# EAGLE design Sensor Acquisition Board Rev1 (EAGLE 9.6.2)
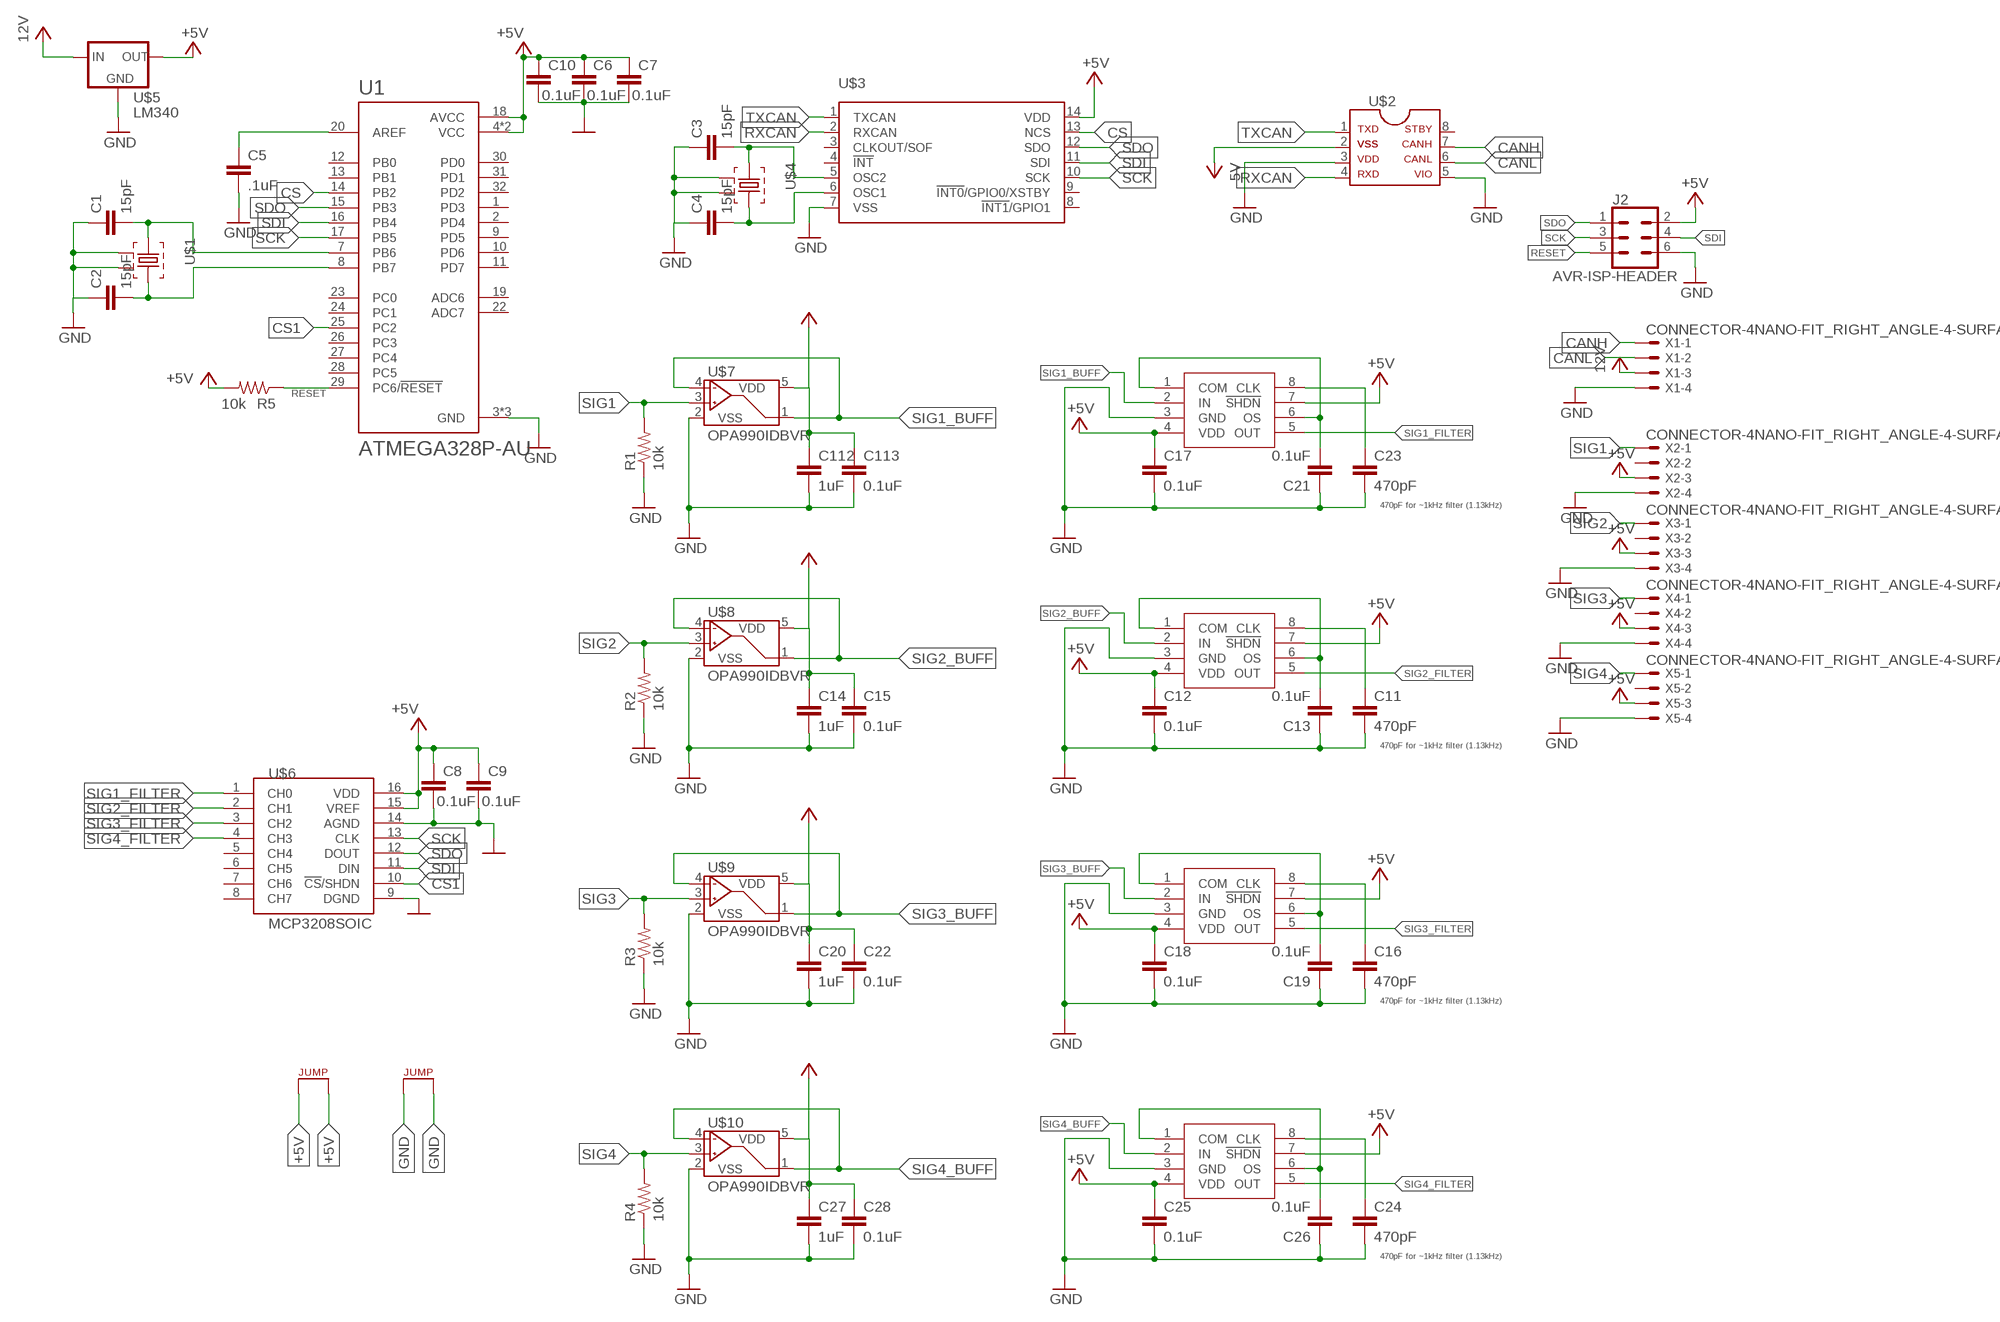
[diagram p0: schematic, sheet 1]

## Parts
C1  15pF  CAP0603-CAP  [0603-CAP]
C2  15pF  CAP0603-CAP  [0603-CAP]
C3  15pF  CAP0603-CAP  [0603-CAP]
C4  15pF  CAP0603-CAP  [0603-CAP]
C5  .1uF  CAP0603-CAP  [0603-CAP]
C6  0.1uF  CAP0603-CAP  [0603-CAP]
C7  0.1uF  CAP0603-CAP  [0603-CAP]
C8  0.1uF  CAP0603-CAP  [0603-CAP]
C9  0.1uF  CAP0603-CAP  [0603-CAP]
C10  0.1uF  CAP0603-CAP  [0603-CAP]
C11  470pF  CAP0603-CAP  [0603-CAP]
C12  0.1uF  CAP0603-CAP  [0603-CAP]
C13  0.1uF  CAP0603-CAP  [0603-CAP]
C14  1uF  CAP0603-CAP  [0603-CAP]
C15  0.1uF  CAP0603-CAP  [0603-CAP]
C16  470pF  CAP0603-CAP  [0603-CAP]
C17  0.1uF  CAP0603-CAP  [0603-CAP]
C18  0.1uF  CAP0603-CAP  [0603-CAP]
C19  0.1uF  CAP0603-CAP  [0603-CAP]
C20  1uF  CAP0603-CAP  [0603-CAP]
C21  0.1uF  CAP0603-CAP  [0603-CAP]
C22  0.1uF  CAP0603-CAP  [0603-CAP]
C23  470pF  CAP0603-CAP  [0603-CAP]
C24  470pF  CAP0603-CAP  [0603-CAP]
C25  0.1uF  CAP0603-CAP  [0603-CAP]
C26  0.1uF  CAP0603-CAP  [0603-CAP]
C27  1uF  CAP0603-CAP  [0603-CAP]
C28  0.1uF  CAP0603-CAP  [0603-CAP]
C112  1uF  CAP0603-CAP  [0603-CAP]
C113  0.1uF  CAP0603-CAP  [0603-CAP]
J1  JUMPER.1  [1X02]
J2  AVR-ISP-HEADER  [2X03]
J3  JUMPER.1  [1X02]
R1  10k  RESISTOR0603  [0603-RES]
R2  10k  RESISTOR0603  [0603-RES]
R3  10k  RESISTOR0603  [0603-RES]
R4  10k  RESISTOR0603  [0603-RES]
R5  10k  RESISTOR0603  [0603-RES]
U1  ATMEGA328P-AU  [QFP80P900X900X120-32N]
U2  MAX7480  [SOIC-08]
U3  MAX7480  [SOIC-08]
U4  MAX7480  [SOIC-08]
U24  MAX7480  [SOIC-08]
U$1  ABM3B  [ABM3B]
U$2  MCP2562FDSOIC-08  [SOIC-08]
U$3  MCP2518FD  [SOIC-14]
U$4  ABM3B  [ABM3B]
U$5  LM340  [SOT223]
U$6  MCP3208SOIC  [SOIC-16]
U$7  OPA990IDBVR  [SOT-23-5]
U$8  OPA990IDBVR  [SOT-23-5]
U$9  OPA990IDBVR  [SOT-23-5]
U$10  OPA990IDBVR  [SOT-23-5]
X1  CONNECTOR-4NANO-FIT_RIGHT_ANGLE-4-SURFACE  [NANO-FIT_RIGHT_ANGLE-4-SURFACE]
X2  CONNECTOR-4NANO-FIT_RIGHT_ANGLE-4-SURFACE  [NANO-FIT_RIGHT_ANGLE-4-SURFACE]
X3  CONNECTOR-4NANO-FIT_RIGHT_ANGLE-4-SURFACE  [NANO-FIT_RIGHT_ANGLE-4-SURFACE]
X4  CONNECTOR-4NANO-FIT_RIGHT_ANGLE-4-SURFACE  [NANO-FIT_RIGHT_ANGLE-4-SURFACE]
X5  CONNECTOR-4NANO-FIT_RIGHT_ANGLE-4-SURFACE  [NANO-FIT_RIGHT_ANGLE-4-SURFACE]

## Nets
+5V: C6.1 C7.1 C8.1 C9.1 C10.1 C12.1 C14.1 C15.1 C17.1 C18.1 C20.1 C22.1 C25.1 C27.1 C28.1 C112.1 C113.1 J1.1 J1.2 J2.2 R5.2 U1.4(VCC) U1.6(VCC) U1.18(AVCC) U2.4(VDD) U2.7(!SHDN) U3.4(VDD) U3.7(!SHDN) U4.4(VDD) U4.7(!SHDN) U24.4(VDD) U24.7(!SHDN) U$3.14(VDD) U$5.3(OUT) U$6.15(VREF) U$6.16(VDD) U$7.5(VDD) U$8.5(VDD) U$9.5(VDD) U$10.5(VDD) X2.3 X3.3 X4.3 X5.3
CANH: U$2.7 X1.1
CANL: U$2.6 X1.2
CS: U1.14(PB2) U$3.13(NCS)
CS1: U1.25(PC2) U$6.10(!CS!/SHDN)
GND: C1.1 C2.1 C3.1 C4.1 C5.2 C6.2 C7.2 C8.2 C9.2 C10.2 C11.2 C12.2 C13.1 C14.2 C15.2 C16.2 C17.2 C18.2 C19.1 C20.2 C21.1 C22.2 C23.2 C24.2 C25.2 C26.1 C27.2 C28.2 C112.2 C113.2 J2.6 J3.1 J3.2 R1.1 R2.1 R3.1 R4.1 U1.3(GND) U1.5(GND) U1.21(GND) U2.3(GND) U3.3(GND) U4.3(GND) U24.3(GND) U$1.GND U$1.GND2 U$2.3 U$2.5 U$3.7(VSS) U$4.GND U$4.GND2 U$5.2(GND) U$5.4(GND) U$6.9(DGND) U$6.14(AGND) U$7.2(VSS) U$8.2(VSS) U$9.2(VSS) U$10.2(VSS) X1.4 X2.4 X3.4 X4.4 X5.4
N$2: C1.2 U1.7(PB6) U$1.1
N$3: C2.2 U1.8(PB7) U$1.3
N$4: C3.2 U$3.5(OSC2) U$4.1
N$5: C4.2 U$3.6(OSC1) U$4.3
N$6: C11.1 U2.8(CLK)
N$7: C13.2 U2.1(COM) U2.6(OS)
N$8: C5.1 U1.20(AREF)
N$9: C16.1 U3.8(CLK)
N$10: C19.2 U3.1(COM) U3.6(OS)
N$11: C24.1 U4.8(CLK)
N$12: C26.2 U4.1(COM) U4.6(OS)
N$136: C23.1 U24.8(CLK)
N$142: C21.2 U24.1(COM) U24.6(OS)
RESET: J2.5 R5.1 U1.29(PC6/!RESET)
RXCAN: U$2.4 U$3.2(RXCAN)
SCK: J2.3 U1.17(PB5) U$3.10(SCK) U$6.13(CLK)
SDI: J2.4 U1.16(PB4) U$3.11(SDI) U$6.11(DIN)
SDO: J2.1 U1.15(PB3) U$3.12(SDO) U$6.12(DOUT)
SIG1: R1.2 U$7.3(VIN+) X2.1
SIG1_BUFF: U24.2(IN) U$7.1(VOUT) U$7.4(VIN-)
SIG1_FILTER: U24.5(OUT) U$6.1(CH0)
SIG2: R2.2 U$8.3(VIN+) X3.1
SIG2_BUFF: U2.2(IN) U$8.1(VOUT) U$8.4(VIN-)
SIG2_FILTER: U2.5(OUT) U$6.2(CH1)
SIG3: R3.2 U$9.3(VIN+) X4.1
SIG3_BUFF: U3.2(IN) U$9.1(VOUT) U$9.4(VIN-)
SIG3_FILTER: U3.5(OUT) U$6.3(CH2)
SIG4: R4.2 U$10.3(VIN+) X5.1
SIG4_BUFF: U4.2(IN) U$10.1(VOUT) U$10.4(VIN-)
SIG4_FILTER: U4.5(OUT) U$6.4(CH3)
TXCAN: U$2.1 U$3.1(TXCAN)
VCC: U$2.2 U$5.1(IN) X1.3 ; supply symbol labelled 5V, 12V
Unconnected: U1.1(PD3) U1.2(PD4) U1.9(PD5) U1.10(PD6) U1.11(PD7) U1.12(PB0) U1.13(PB1) U1.19(ADC6) U1.22(ADC7) U1.23(PC0) U1.24(PC1) U1.26(PC3) U1.27(PC4) U1.28(PC5) U1.30(PD0) U1.31(PD1) U1.32(PD2) U$2.8 U$3.3(CLKOUT/SOF) U$3.4(!INT!) U$3.8(!INT1!/GPIO1) U$3.9(!INT0!/GPIO0/XSTBY) U$6.5(CH4) U$6.6(CH5) U$6.7(CH6) U$6.8(CH7) X2.2 X3.2 X4.2 X5.2

## Notes on the sheet
- 470pF for ~1kHz filter (1.13kHz)
- 470pF for ~1kHz filter (1.13kHz)
- 470pF for ~1kHz filter (1.13kHz)
- 470pF for ~1kHz filter (1.13kHz)

## Library data of the parts
C1-C28 C112 C113 = HyTechDevices:CAP: Capacitor Standard 0603 ceramic capacitor, and 0.1" leaded capacitor.
J1 J3 = HyTechDevices:JUMPER: Jumper for changing operation of a device
J2 = HyTechDevices:AVR-ISP-HEADER: AVR ISP 6-pin Header Reference <https://en.wikipedia.org/wiki/In-system_programming>; DIGIKEY: S2011EC-03-ND
R1-R5 = HyTechDevices:RESISTOR: Resistor Basic schematic elements and footprints for 0603, 1206, and PTH resistors.
U1 = HyTechDevices:ATMEGA328P-AU: ATmega Series 20 MHz 32 KB Flash 2 KB SRAM 8-Bit Microcontroller - TQFP-32; AVAILABILITY: Unavailable; DESCRIPTION: AVR AVR® ATmega Microcontroller IC 8-Bit 20MHz 32KB _16K x 16_ FLASH 32-TQFP _7x7_; MF: Microchip; MP: ATMEGA328P-AU; PACKAGE: TQFP-32 Microchip; PRICE: None
U2-U4 U24 = HyTechDevices:MAX7480: 8th-order lowpass butterworth filter
U$1 U$4 = HyTechDevices:ABM3B: ABM3B ceramic SMD crystal. Datasheet <https://www.mouser.com/datasheet/2/3/abm3b-39910.pdf>
U$2 = HyTechDevices:MCP2562FD: MCP2562FD High-speed CAN Transceiver Datatsheet <http://ww1.microchip.com/downloads/en/devicedoc/20005167c.pdf>
U$3 = HyTechDevices:MCP2518FD: MCP2518FD - External CAN FD Controller with SPI Interface Datasheet <https://ww1.microchip.com/downloads/en/DeviceDoc/External-CAN-FD-Controller-with-SPI-Interface-DS20006027B.pdf>
U$5 = HyTechDevices:LM340: LM340 7.5-35V to 5V SMD regulator Mouser link <https://www.mouser.com/ProductDetail/Texas-Instruments/LM340MPX-50-NOPB?qs=sGAEpiMZZMvu8NZDyZ4K0cQiG3JqdhEW>
U$6 = HyTechDevices:MCP3208: Analog to Digital Converter
U$7-U$10 = HyTechDevices:OPA990IDBVR: TI OPA990 20V Op-Amp Comparator Datasheet <https://www.ti.com/lit/ds/symlink/opa990.pdf>
X1-X5 = HyTechDevices:CONNECTOR-4: Mini-Fit Junior connector 4 pole Source: http://www.molex.com

## Board
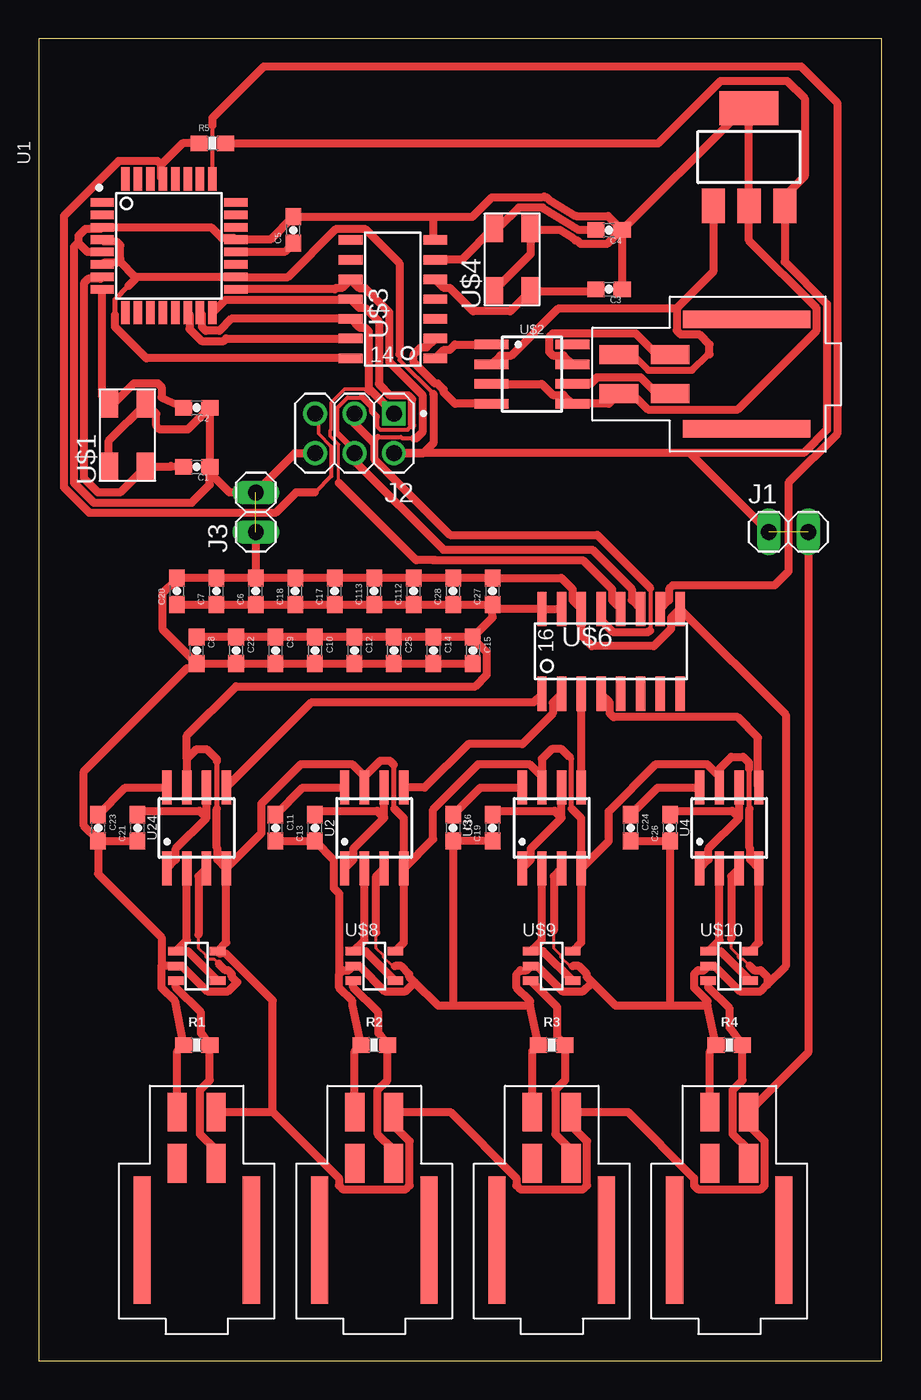
[diagram p1: board, top side]

Size 54.28 x 85.08 mm. Coordinates in mm from the lower left corner, seen from the top.
Outline: 0,0 54.28,0 54.28,85.08 0,85.08 0,0
Copper layers (1*16): Top 0.035mm / dielectric 1.5mm / Bottom 0.035mm
Design rules "default": minimum track width 6mil, minimum drill 0.35mm, track to track 6mil, track to pad 6mil, pad to pad 6mil, via to via 6mil, smd to smd 6mil, copper to edge 40mil, drill to drill 6mil, minimum pad ring 10mil, minimum via ring 8mil, stop-mask expansion 4mil, vias tented up to drill 0mil, thermal gap 10mil

### Footprints (pad centres in the part's own frame; a part is rotated, then mirrored left to right if it is on the bottom)
0603-CAP = smd 1.1 x 1: 1 -0.85,0; 2 0.85,0
1X02 = drill 1.016 long: 1 -1.27,0; 2 1.27,0
2X03 = drill 1.016 square: 1 -2.54,-1.27 | drill 1.016: 2 -2.54,1.27; 3 0,-1.27; 4 0,1.27; 5 2.54,-1.27; 6 2.54,1.27
0603-RES = smd 1.1 x 1: 1 -0.85,0; 2 0.85,0
QFP80P900X900X120-32N = smd 1.5 x 0.55: 1 -4.3,2.8; 2 -4.3,2; 3 -4.3,1.2; 4 -4.3,0.4; 5 -4.3,-0.4; 6 -4.3,-1.2; 7 -4.3,-2; 8 -4.3,-2.8; 17 4.3,-2.8; 18 4.3,-2; 19 4.3,-1.2; 20 4.3,-0.4; 21 4.3,0.4; 22 4.3,1.2; 23 4.3,2; 24 4.3,2.8 | smd 0.55 x 1.5: 9 -2.8,-4.3; 10 -2,-4.3; 11 -1.2,-4.3; 12 -0.4,-4.3; 13 0.4,-4.3; 14 1.2,-4.3; 15 2,-4.3; 16 2.8,-4.3; 25 2.8,4.3; 26 2,4.3; 27 1.2,4.3; 28 0.4,4.3; 29 -0.4,4.3; 30 -1.2,4.3; 31 -2,4.3; 32 -2.8,4.3
SOIC-08 = smd 0.6 x 2.2: 1 -1.905,-2.6; 2 -0.635,-2.6; 3 0.635,-2.6; 4 1.905,-2.6; 5 1.905,2.6; 6 0.635,2.6; 7 -0.635,2.6; 8 -1.905,2.6
ABM3B = smd 1.803 x 1.194: 1 0.902,0.597; 3 4.966,2.985; GND 0.902,2.985; GND2 4.966,0.597
SOIC-14 = smd 0.61 x 1.524: 1 -4.445,-2.794; 2 -3.175,-2.794; 3 -1.905,-2.794; 4 -0.635,-2.794; 5 0.635,-2.794; 6 1.905,-2.794; 7 3.175,-2.794; 8 3.175,2.667; 9 1.905,2.667; 10 0.635,2.667; 11 -0.635,2.667; 12 -1.905,2.667; 13 -3.175,2.667; 14 -4.445,2.667
SOT223 = smd 1.5 x 2.235: 1 -2.3,-3.15; 2 0,-3.15; 3 2.3,-3.15 | smd 3.8 x 2.2: 4 0,3.15
SOIC-16 = smd 0.6 x 2.2: 1 -4.445,-2.794; 2 -3.175,-2.794; 3 -1.905,-2.794; 4 -0.635,-2.794; 5 0.635,-2.794; 6 1.905,-2.794; 7 3.175,-2.794; 8 4.445,-2.794; 9 4.445,2.667; 10 3.175,2.667; 11 1.905,2.667; 12 0.635,2.667; 13 -0.635,2.667; 14 -1.905,2.667; 15 -3.175,2.667; 16 -4.445,2.667
SOT-23-5 = smd 1 x 0.55: 1 -1.35,0.95; 2 -1.35,0; 3 -1.35,-0.95; 4 1.35,-0.95; 5 1.35,0.95
NANO-FIT_RIGHT_ANGLE-4-SURFACE = smd 1.24 x 2.5: 1 1.25,0; 2 -1.25,0; 3 1.25,3.3; 4 -1.25,3.3 | smd 1.1 x 8.2: P$5 -3.52,-4.93; P$6 3.52,-4.93

### Placement (x,y rotation side)
C1  10.16,57.53 180 top
C2  10.16,61.34 180 top
C3  36.7,68.96 180 top
C4  36.7,72.77 180 top
C5  16.38,72.77 90 top
C6  13.97,49.53 90 top
C7  11.43,49.53 90 top
C8  10.16,45.72 270 top
C9  15.24,45.72 270 top
C10  17.78,45.72 270 top
C11  15.24,34.29 270 top
C12  20.32,45.72 270 top
C13  17.78,34.29 90 top
C14  25.4,45.72 270 top
C15  27.94,45.72 270 top
C16  26.67,34.29 270 top
C17  19.05,49.53 90 top
C18  16.51,49.53 90 top
C19  29.21,34.29 90 top
C20  8.89,49.53 90 top
C21  6.35,34.29 90 top
C22  12.7,45.72 270 top
C23  3.81,34.29 270 top
C24  38.1,34.29 270 top
C25  22.86,45.72 270 top
C26  40.64,34.29 90 top
C27  29.21,49.53 90 top
C28  26.67,49.53 90 top
C112  24.13,49.53 90 top
C113  21.59,49.53 90 top
J1  48.26,53.34 0 top
J2  20.32,59.69 180 top
J3  13.97,54.61 90 top
R1  10.16,20.32 0 top
R2  21.59,20.32 0 top
R3  33.02,20.32 0 top
R4  44.45,20.32 0 top
R5  11.18,78.36 0 top
U1  8.38,71.75 0 top
U2  21.59,34.29 0 top
U3  33.02,34.29 0 top
U4  44.45,34.29 0 top
U24  10.16,34.29 0 top
U$1  7.49,56.64 90 top
U$2  31.75,63.5 270 top
U$3  22.73,68.96 90 top
U$4  32.26,67.94 90 top
U$5  45.72,77.47 0 top
U$6  36.83,45.72 0 top
U$7  10.16,25.4 0 top
U$8  21.59,25.4 0 top
U$9  33.02,25.4 0 top
U$10  44.45,25.4 0 top
X1  40.64,63.5 90 top
X2  10.16,12.7 0 top
X3  21.59,12.7 0 top
X4  33.02,12.7 0 top
X5  44.45,12.7 0 top

### Tracks (layer width: path | path; a pad name or v marks a point on that pad's centre or on a via)
+5V  (1 unrouted)
  Top 0.254: 23.22,64.77 23.22,64.41 25.4,62.23
  Top 0.33: 34.31,35.52 34.29,35.55 34.29,38.73 34.16,38.86 | 22.89,35.52 22.86,35.55 22.86,38.35 | 45.74,35.52 45.74,35.65 45.73,35.67 45.73,38.1 | 11.46,35.52 11.46,35.65 11.45,35.66 11.45,38.59 | 4.9,67.31 4.9,68.3 5.77,69.16
  Top 0.508: U$8.5 23.5,26.91 U2.4 | U$9.5 34.92,26.91 U3.4 | U$10.5 46.35,26.91 U4.4 45.79,32.25 45.79,32.96 45.74,33 45.74,35.52 | U24.4 12.07,26.91 U$7.5 11.65,26.21 12.03,26.21 15.07,23.18 15.07,16 | U$6.15 U$6.16 29.5,48.39 C27.1 | U2.4 25.38,33.58 25.38,35.48 28.3,38.4 31.58,38.4 32.39,37.59 | U3.4 36.69,33.45 36.69,35.35 39.73,38.4 43.01,38.4 43.81,37.59 U4.7 43.81,38.1 44.58,38.86 45.34,38.86 45.73,38.47 45.73,38.1 | U24.4 14.33,33.96 14.33,35.86 16.87,38.4 20.15,38.4 20.96,37.59 | U3.4 34.92,34.91 34.31,35.52 | 32.39,37.59 U3.7 | U2.4 23.5,34.91 22.89,35.52 | 22.86,38.35 22.61,38.61 21.97,38.61 20.96,37.59 | 20.96,37.59 U2.7 | U24.4 11.5,32.25 11.5,32.96 11.46,33 11.46,35.52 | 5.24,70.91 5.24,71.8 5,72.04 4.2,72.04 U1.4 | C15.1 27.94,46.49 28.85,45.59 28.85,44.15 28.1,43.41 12.7,43.41 9.52,40.23 9.52,38.73 | C20.1 C7.1 C6.1 C18.1 C17.1 C113.1 C112.1 C28.1 C27.1 | C15.1 29.21,47.84 C27.1 | C15.1 C14.1 C25.1 C12.1 C10.1 C9.1 C22.1 C8.1 | 9.52,38.73 10.16,39.37 10.79,39.37 11.45,38.72 11.45,38.59 | 9.52,38.73 U24.7 | 15.07,16 19.31,11.75 19.31,11.28 19.55,11.04 23.63,11.04 23.87,11.28 23.87,14.12 22.84,15.14 X3.3 26.5,16 30.74,11.75 30.74,11.28 30.98,11.04 35.06,11.04 35.3,11.28 35.3,14.12 34.27,15.14 X4.3 37.92,16 42.17,11.75 42.17,11.28 42.41,11.04 46.49,11.04 46.73,11.28 46.73,14.12 45.7,15.14 X5.3 49.53,19.83 J1.2 | 4.9,67.31 4.9,66.54 6.92,64.52 U$3.14 | 5.24,70.91 5,70.67 4.2,70.67 U1.6 | 6.22,69.75 U1.18 16.04,69.75 19.14,72.85 21,72.85 23.22,70.63 23.22,64.77 | 25.4,62.23 25.4,59.05 24.79,58.44 24.81,58.42 J2.2 41.91,58.42 | 41.91,58.42 49.23,58.42 50.74,59.92 50.74,68.01 48.02,70.73 U$5.3 48.02,74.95 49.3,76.23 49.3,81.25 48.17,82.38 43.91,82.38 39.88,78.36 R5.2
  Top 0.508: 5.77,69.16 6.22,69.62 6.22,69.75 | 6.22,69.75 5.24,70.73 5.24,70.91 | X2.3 15.07,16 | J1.1 41.91,58.42 | 34.16,38.86 33.66,39.37 33.02,39.37 32.39,38.73 32.39,37.59
CANH
  Top 0.508: X1.1 39.78,64.75 38.42,66.11 33.08,66.11 32.84,65.87 32.84,64.94 33.08,64.7 33.79,64.7 U$2.7
CANL
  Top 0.508: X1.2 39.78,62.25 38.76,63.28 35.92,63.28 35.51,62.87 U$2.6
CS
  Top 0.508: U1.14 9.7,67.34 9.7,66.4 10.46,65.64 11.9,65.64 12.05,65.79 U$3.13
CS1
  Top 0.254: U1.25 11.18,79.5
  Top 0.508: 11.18,79.5 11.18,79.99 14.48,83.3 49.08,83.3 51.4,80.97 51.4,59.65 48.26,56.51 48.26,50.8 47.35,49.89 40.81,49.89 40.57,49.66 40.57,48.95 U$6.10
GND  (1 unrouted)
  Top 0.203: 22.92,25.4 22.76,25.4 22.19,25.97 22.19,26.07 21.72,26.54 21.72,27.56 | 34.35,25.4 34.19,25.4 33.62,25.97 33.62,26.07 33.15,26.54 33.15,27.69 | 11.58,25.55 11.31,25.82 10.9,25.82 10.76,25.97 10.76,26.07 10.29,26.54 10.29,27.43 | 45.75,25.43 45.36,25.82 45.19,25.82 45.05,25.97 45.05,26.07 44.58,26.54 44.58,27.18
  Top 0.508: 19.33,24.89 19.33,24.01 20.19,23.15 20.19,22.86 R2.1 20.34,19.92 X3.4 | 19.33,24.89 19.57,25.13 19.97,25.13 U$8.2 20.64,25.4 22.27,23.77 23.61,23.77 24.2,24.36 | 31.62,22.86 R3.1 31.77,19.92 X4.4 | 31.62,22.86 31.62,23.15 30.76,24.01 30.76,24.89 31,25.13 31.4,25.13 U$9.2 32.07,25.4 33.7,23.77 35.04,23.77 35.63,24.36 | 43.05,22.86 R4.1 43.2,19.92 X5.4 | 43.05,22.86 43.05,23.15 42.19,24.01 42.19,24.89 42.43,25.13 42.83,25.13 U$10.2 43.5,25.4 45.13,23.77 46.47,23.77 46.91,24.21 | 46.91,24.21 48.08,25.38 48.08,41.59 U$6.9 40.71,47.82 40.71,47.12 39.58,45.99 35.6,45.99 34.92,46.67 U$6.14 34.36,48.95 34.36,49.66 33.64,50.38 C27.2 C28.2 C112.2 C113.2 C17.2 C18.2 C6.2 | 7.9,25.4 7.9,24.01 8.76,23.15 R1.1 8.91,19.92 X2.4 | 24.2,24.36 25.7,22.86 26.67,22.86 | 26.67,22.86 31.62,22.86 | 35.63,24.36 37.13,22.86 40.64,22.86 | 40.64,22.86 43.05,22.86 | 45.72,80.01 U$5.2 45.72,72.09 50.08,67.74 50.08,66.3 45,61.22 39.22,61.22 38.19,62.25 X1.4 36.69,61.59 U$2.5 33.79,62.16 33.08,62.16 32.38,62.87 U$2.3 | 45.72,80.01 U$5.4 | C8.2 C22.2 C9.2 C10.2 C12.2 C25.2 C14.2 C15.2 | C6.2 C7.2 C20.2 8.89,50.3 7.98,49.4 7.98,47.05 C8.2 | C26.1 40.64,33.02 | 40.64,33.02 40.64,22.86 | 26.67,22.86 C16.2 C19.1 | 7.9,25.4 7.9,27.24 3.81,31.33 C23.2 | C11.2 C13.1 18.98,32.24 18.98,30.42 19.33,30.07 19.33,24.89 | C24.2 40.22,33.44 40.64,33.02 | U1.5 4.06,71.38 3.13,71.38 2.54,71.96 | 24.2,24.36 23.85,24.72 23.85,24.89 23.34,25.4 22.92,25.4 | U2.3 21.72,31.18 21.72,27.56 | 35.63,24.36 35.28,24.72 35.28,24.89 34.77,25.4 34.35,25.4 | U3.3 33.15,31.18 33.15,27.69 | 11.58,25.55 12,25.13 12.18,25.13 12.42,24.89 12.42,24.72 12.77,24.36 12.18,23.77 10.84,23.77 9.21,25.4 U$7.2 7.9,25.4
  Top 0.508: U24.3 10.29,31.18 10.29,27.43 | C23.2 C21.1 | 44.58,27.18 44.58,31.18 U4.3 | C4.1 C3.1 | C4.1 37.48,72.77 36.57,71.86 34.89,71.86 34.69,72.06 34.62,72.11 34.53,72.11 34.39,72.25 33.53,72.77 31.8,72.77 U$4.GND2 31.66,71.23 U$4.GND | U$1.GND 4.51,59.22 U$1.GND2 7.55,60.95 7.55,60.17 7.79,59.94 9.58,59.94 10.99,61.34 C2.1 C1.1 11.01,57.15 | C23.2 3.81,33.52 2.9,34.42 2.9,37.94 9.54,44.57 9.86,44.57 C8.2 | 2.54,71.96 2.54,72.39 2.99,72.84 3.96,72.84 U1.3 11.08,72.95 11.76,72.27 12.56,72.27 U1.21 14.92,72.16 C5.2 25.4,73.62 | 2.54,71.96 2.27,71.69 2.27,56.49 3.54,55.22 9.84,55.22 11.01,56.38 11.01,57.15 | C4.1 36.65,73.68 34.58,73.68 32.84,74.74 32.7,74.88 32.61,74.88 32.54,74.92 32.35,74.88 29.17,74.88 27.91,73.62 25.4,73.62 | 45.72,80.01 44.79,80.01 C4.1 | U$3.7 25.4,72.26 25.4,73.62 | J3.1 C6.2 | 11.01,57.15 12.28,55.88 J3.2 16.51,58.42 J2.6 | 45.75,25.43 46.05,25.13 46.47,25.13 46.91,24.69 46.91,24.21
N$2
  Top 0.508: C1.2 8.5,57.59 8.46,57.54 U$1.1 5.23,55.88 3.81,55.88 2.93,56.76 2.93,69.4 3.16,69.64 3.96,69.64 U1.7
N$3
  Top 0.508: C2.2 7.9,62 7.9,62.68 7.66,62.92 6.13,62.92 4.82,61.61 U$1.3 4.08,62.03 U1.8
N$4
  Top 0.508: U$3.5 26.09,69.04 26.46,69.04 27.96,67.54 30.35,67.54 U$4.1 35.74,68.85 C3.2
N$5
  Top 0.508: C4.2 34.8,72.77 32.43,74.22 30.9,74.22 29.59,72.91 U$4.3 27.23,70.87 U$3.6
N$6
  Top 0.508: C11.1 16.99,36.89 U2.8
N$7
  Top 0.508: U2.1 20.25,32.25 20.25,32.96 22.22,34.94 | 22.22,34.94 U2.6 | C13.2 18.02,35.38 21.78,35.38 22.22,34.94
N$8
  Top 0.508: C5.1 15.82,71.36 U1.20
N$9
  Top 0.508: C16.1 28.42,36.89 U3.8
N$10
  Top 0.508: U3.1 31.68,32.25 31.68,32.96 33.66,34.94 | 33.66,34.94 U3.6 | C19.2 29.45,35.38 33.21,35.38 33.66,34.94
N$11
  Top 0.508: C24.1 39.85,36.89 U4.8
N$12
  Top 0.508: U4.1 43.11,32.25 43.11,32.96 45.08,34.94 | 45.08,34.94 U4.6 | C26.2 40.88,35.38 44.64,35.38 45.08,34.94
N$136
  Top 0.508: C23.1 5.56,36.89 U24.8
N$142
  Top 0.508: U24.1 8.82,32.25 8.82,32.96 10.79,34.94 | 10.79,34.94 U24.6 | C21.2 6.59,35.38 10.35,35.38 10.79,34.94
RESET
  Top 0.229: J2.5 18,60.74 18,59.66 18.81,58.85
  Top 0.254: 17.78,55.88 18.82,56.92 18.82,58.83 18.81,58.85
  Top 0.508: 7.86,76.97 7.62,77.21 5.14,77.21 1.61,73.68 1.61,56.22 3.26,54.56 15.24,54.56 16.56,55.88 17.78,55.88 | U1.29 7.86,76.17 7.86,76.97 | R5.1 9.25,78.36 7.86,76.97
RXCAN
  Top 0.508: U$2.4 26.8,61.59 26.06,62.33 26.06,62.5 25.67,62.89 25.5,62.89 24.13,64.26 24.13,64.76 24.6,65.23 24.97,65.23 U$3.2
SCK
  Top 0.254: 24.13,59.37 23.38,59.37 23.29,59.46 21.82,59.46 | 39.37,49.73 39.37,46.99
  Top 0.381: 21.59,59.23 21.82,59.46
  Top 0.508: U1.17 19.05,68.95 19.14,69.04 19.51,69.04 U$3.10 20.63,69.04 21,69.04 22.56,67.48 22.56,64.3 24.69,62.16 24.69,59.76 24.3,59.37 24.13,59.37 | U$6.13 36.19,47.68 37,46.88 39.2,46.88 39.31,46.99 39.37,46.99 | 21.59,59.05 20.32,60.33 J2.3 | 21.59,59.05 21.59,58.04 26.48,53.15 35.95,53.15 39.37,49.73 | 21.59,59.23 21.59,59.05
SDI
  Top 0.254: 21.75,60.8 21.82,60.73 21.82,60.08 21.98,59.92 23.74,59.92 24.03,60.21 | 19.21,59.69 19.21,61.33 19.89,62 20.71,62 20.78,62.06
  Top 0.381: 20.78,62.06 21.43,61.42 21.43,61.12 21.75,60.8 | 19.21,59.69 20.19,58.71 20.19,58.55 J2.4
  Top 0.508: U1.16 12,68.27 19.31,68.27 19.36,68.33 U$3.11 20.63,67.77 21,67.77 21.89,66.87 21.89,62.86 22.63,62.13 23.79,62.13 24.03,61.89 24.03,60.21 | J2.4 20.32,57.91 26.04,52.19 35.64,52.19 38.17,49.66 38.17,48.95 U$6.11
SDO
  Top 0.203: 19.3,56.52 19.3,58.95
  Top 0.229: 21.59,62.23 21.26,62.23 20.97,62.52 19.67,62.52 18.82,61.67 18.82,59.94 18.76,59.88 18.76,59.5 19.3,58.95
  Top 0.508: U1.15 10.5,67.34 10.5,66.54 10.74,66.3 11.63,66.3 12.38,67.06 U$3.12 20.63,66.5 21,66.5 21.23,66.26 21.23,62.59 21.59,62.23 J2.1 | U$6.12 36.9,48.95 36.9,49.66 35.03,51.53 25.56,51.53 25.4,51.53 24.29,51.53 19.3,56.52
SIG1
  Top 0.508: U$7.3 8.81,24.03 10.44,22.41 10.44,21.09 R1.2 11.01,18.05 10.38,17.42 10.38,14.58 11.41,13.55 X2.1
SIG1_BUFF
  Top 0.508: U$7.4 9.61,26.35 U$7.1 9.52,27.07 U24.2
SIG1_FILTER
  Top 0.508: U24.5 17.57,42.39 31.85,42.39 U$6.1
SIG2
  Top 0.508: U$8.3 20.24,24.03 21.87,22.41 21.87,21.09 R2.2 22.44,18.05 21.81,17.42 21.81,14.58 22.84,13.55 X3.1
SIG2_BUFF
  Top 0.508: U$8.4 21.04,26.35 U$8.1 20.96,27.07 U2.2
SIG2_FILTER
  Top 0.508: U$6.2 33.09,42.36 33.09,41.66 31.13,39.69 27.65,39.69 24.85,36.89 U2.5
SIG3
  Top 0.508: X4.1 34.27,13.55 33.44,14.39 | 33.24,14.58 33.44,14.39 | U$9.3 33.36,22.76 33.36,20.83 R3.2 33.87,18.05 33.24,17.42 33.24,14.58 | 33.24,14.58 33.44,14.39
SIG3_BUFF
  Top 0.508: U$9.4 32.47,26.35 U$9.1 32.39,27.07 U3.2
SIG3_FILTER
  Top 0.508: U3.5 U$6.3
SIG4
  Top 0.508: U$10.3 43.1,24.03 44.47,22.66 44.47,21.43 R4.2 45.3,18.05 44.67,17.42 44.67,14.58 45.7,13.55 X5.1
SIG4_BUFF
  Top 0.508: U$10.4 43.9,26.35 U$10.1 43.81,27.07 U4.2
SIG4_FILTER
  Top 0.508: U4.5 46.3,36.95 46.3,40.11 44.98,41.42 37,41.42 36.76,41.66 36.76,42.36 U$6.4
TXCAN
  Top 0.508: U$3.1 26.09,65.08 26.46,65.08 26.79,65.41 U$2.1
VCC
  Top 0.457: 43.18,64.77 43.07,64.77 42.05,63.75 39.23,63.75 38.23,64.75 X1.3
  Top 0.508: 43.18,64.77 43.18,65.41 42.52,66.06 41.3,66.06 41.06,66.3 41.06,67.74 | U$5.1 43.42,70.09 41.06,67.74 | U$2.2 29.71,64.7 30.42,64.7 33.46,67.74 41.06,67.74